# EAGLE schematic alimentare (EAGLE 6.6.0)
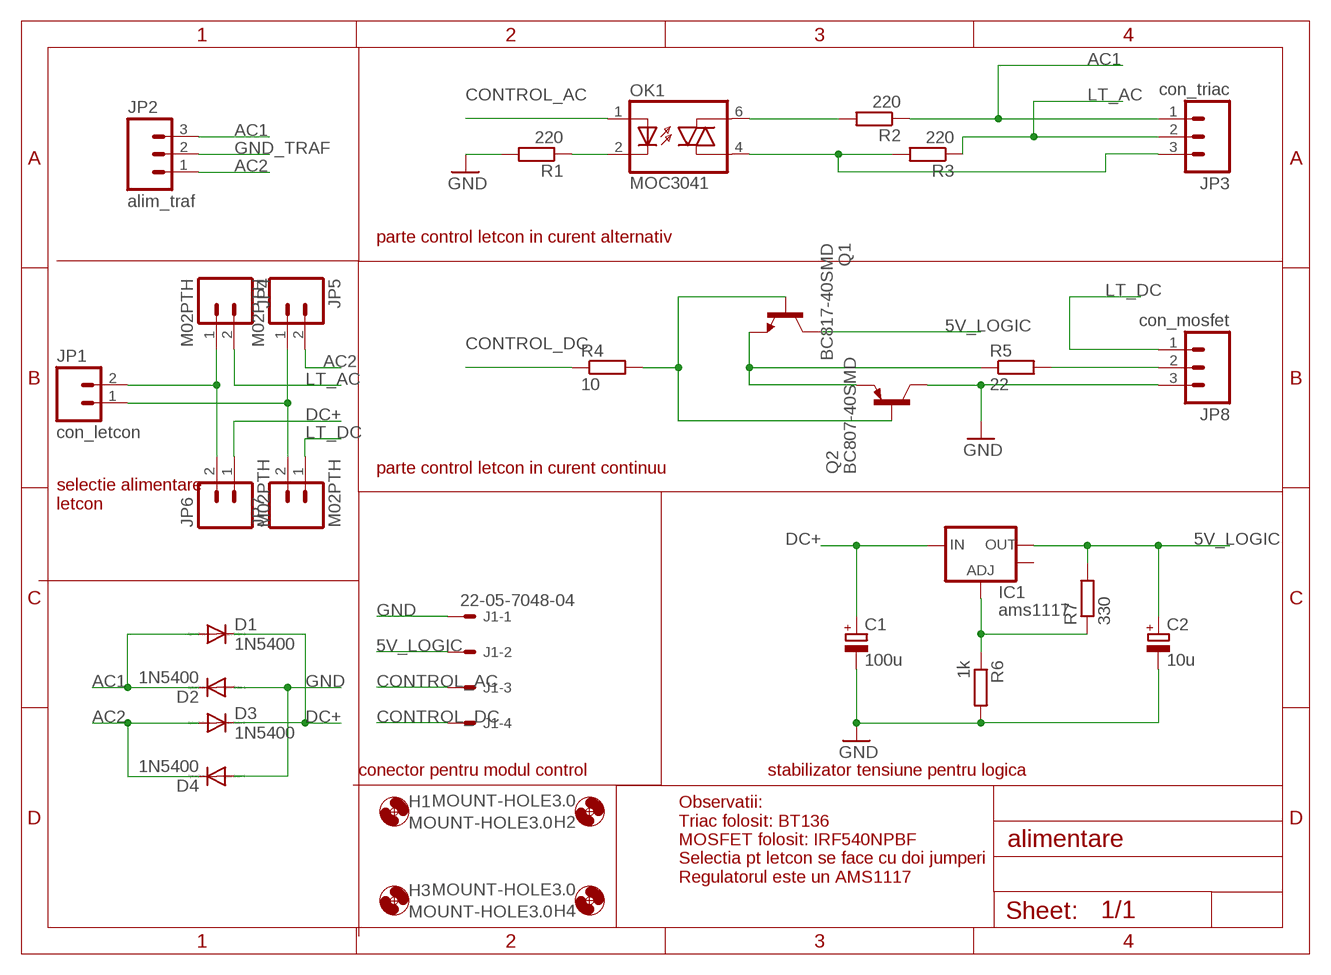
[diagram p0: schematic, sheet 1]

## Parts
C1  100u  CPOL-EUE2,5-6E  [E2,5-6E]
C2  10u  CPOL-EUE2,5-6E  [E2,5-6E]
D1  1N5400  [DO201-15]
D2  1N5400  [DO201-15]
D3  1N5400  [DO201-15]
D4  1N5400  [DO201-15]
H1  MOUNT-HOLE3.0  [3,0]
H2  MOUNT-HOLE3.0  [3,0]
H3  MOUNT-HOLE3.0  [3,0]
H4  MOUNT-HOLE3.0  [3,0]
IC1  ams1117  V_REG_LM1117SOT223  [SOT223]
J1  22-05-7048-04  [7395-04]
JP1  con_letcon  M023.5MM  [SCREWTERMINAL-3.5MM-2]
JP2  alim_traf  M03SCREW  [SCREWTERMINAL-3.5MM-3]
JP3  con_triac  M03POLAR  [MOLEX-1X3]
JP4  M02PTH  [1X02]
JP5  M02PTH  [1X02]
JP6  M02PTH  [1X02]
JP7  M02PTH  [1X02]
JP8  con_mosfet  M03POLAR  [MOLEX-1X3]
OK1  MOC3041  MOC3010  [DIL06]
Q1  BC817-40SMD  [SOT23-BEC]
Q2  BC807-40SMD  [SOT23-BEC]
R1  220  R-EU_M1206  [M1206]
R2  220  R-EU_M1206  [M1206]
R3  220  R-EU_M1206  [M1206]
R4  10  R-EU_M1206  [M1206]
R5  22  R-EU_M1206  [M1206]
R6  1k  R-EU_M1206  [M1206]
R7  330  R-EU_M1206  [M1206]

## Nets
5V_LOGIC: C2.+ IC1.2(OUT) J1.2 Q1.C R7.2
AC1: D1.A D2.C JP2.3 JP3.1 R2.1
AC2: D3.A D4.C JP2.1 JP5.2
CONTROL_AC: J1.3 OK1.1(A)
CONTROL_DC: J1.4 R4.1
DC+: C1.+ D1.C D3.C IC1.3(IN) JP6.1
GND: C1.- C2.- D2.A D4.A J1.1 JP8.3 Q2.C R1.2 R6.2
GND_TRAF: JP2.2
LT_AC: JP3.2 JP4.2 R3.1
LT_DC: JP7.1 JP8.1
N$1: OK1.2(C) R1.1
N$2: OK1.6(A2) R2.2
N$3: JP1.2 JP4.1 JP6.2
N$4: JP3.3 OK1.4(A1) R3.2
N$5: Q1.E Q2.E R5.1
N$6: JP1.1 JP5.1 JP7.2
N$7: Q1.B Q2.B R4.2
N$8: JP8.2 R5.2
N$10: IC1.1(ADJ) R6.1 R7.1
Unconnected: IC1.4(OUT)

## Notes on the sheet
- parte control letcon in curent alternativ
- parte control letcon in curent continuu
- selectie alimentare
  letcon
- conector pentru modul control | stabilizator tensiune pentru logica
- Observatii:
  Triac folosit: BT136
  MOSFET folosit: IRF540NPBF
  Selectia pt letcon se face cu doi jumperi
  Regulatorul este un AMS1117

## Library data of the parts
C1 C2 = resistor:CPOL-EU: POLARIZED CAPACITOR, European symbol
D1-D4 = diode:1N5400: DIODE standard rectifier, 3 A, 50 V (Motorola)
H1-H4 = holes:MOUNT-HOLE: MOUNTING HOLE with drill center marker
IC1 = SparkFun-PowerIC:V_REG_LM1117: Voltage Regulator LM1117 Standard adjustable voltage regulator but in SMD form. Spark Fun Electronics SKU : COM-00595
J1 = con-molex:22-?-04: CONNECTOR wire to board 2.54 mm (.1 inch) pitch header; OC_FARNELL: unknown; OC_NEWARK: unknown
JP1 JP4-JP7 = SparkFun-Connectors:M02: Standard 2-pin 0.1" header. Use with - straight break away headers ( PRT-00116) - right angle break away headers (PRT-00553) - swiss pins (PRT-00743) - machine pins (PRT-00117) - female headers (PRT-00115) Molex polarized connector foot print use with: PRT-08233 with associated crimp pins and housings. 2.54_SCREWTERM for use with PRT-10571. 3.5mm Screw Terminal footprints for PRT-08084 5mm Screw Terminal footprints for use with PRT-08433
JP2 JP3 JP8 = SparkFun-Connectors:M03: Header 3 Standard 3-pin 0.1" header. Use with straight break away headers (SKU : PRT-00116), right angle break away headers (PRT-00553), swiss pins (PRT-00743), machine pins (PRT-00117), and female headers (PRT-00115). Molex polarized connector foot print use with SKU : PRT-08232 with associated crimp pins and housings.
OK1 = moc3010:MOC3010: SIEMENS OPTO COUPLER
Q1 = transistor-npn:BC817*: NPN Transistor
Q2 = transistor-pnp:BC807*: PNP Transistror
R1-R7 = resistor:R-EU_: RESISTOR, European symbol